# EAGLE design cerebro5.8 (EAGLE 9.6.2)
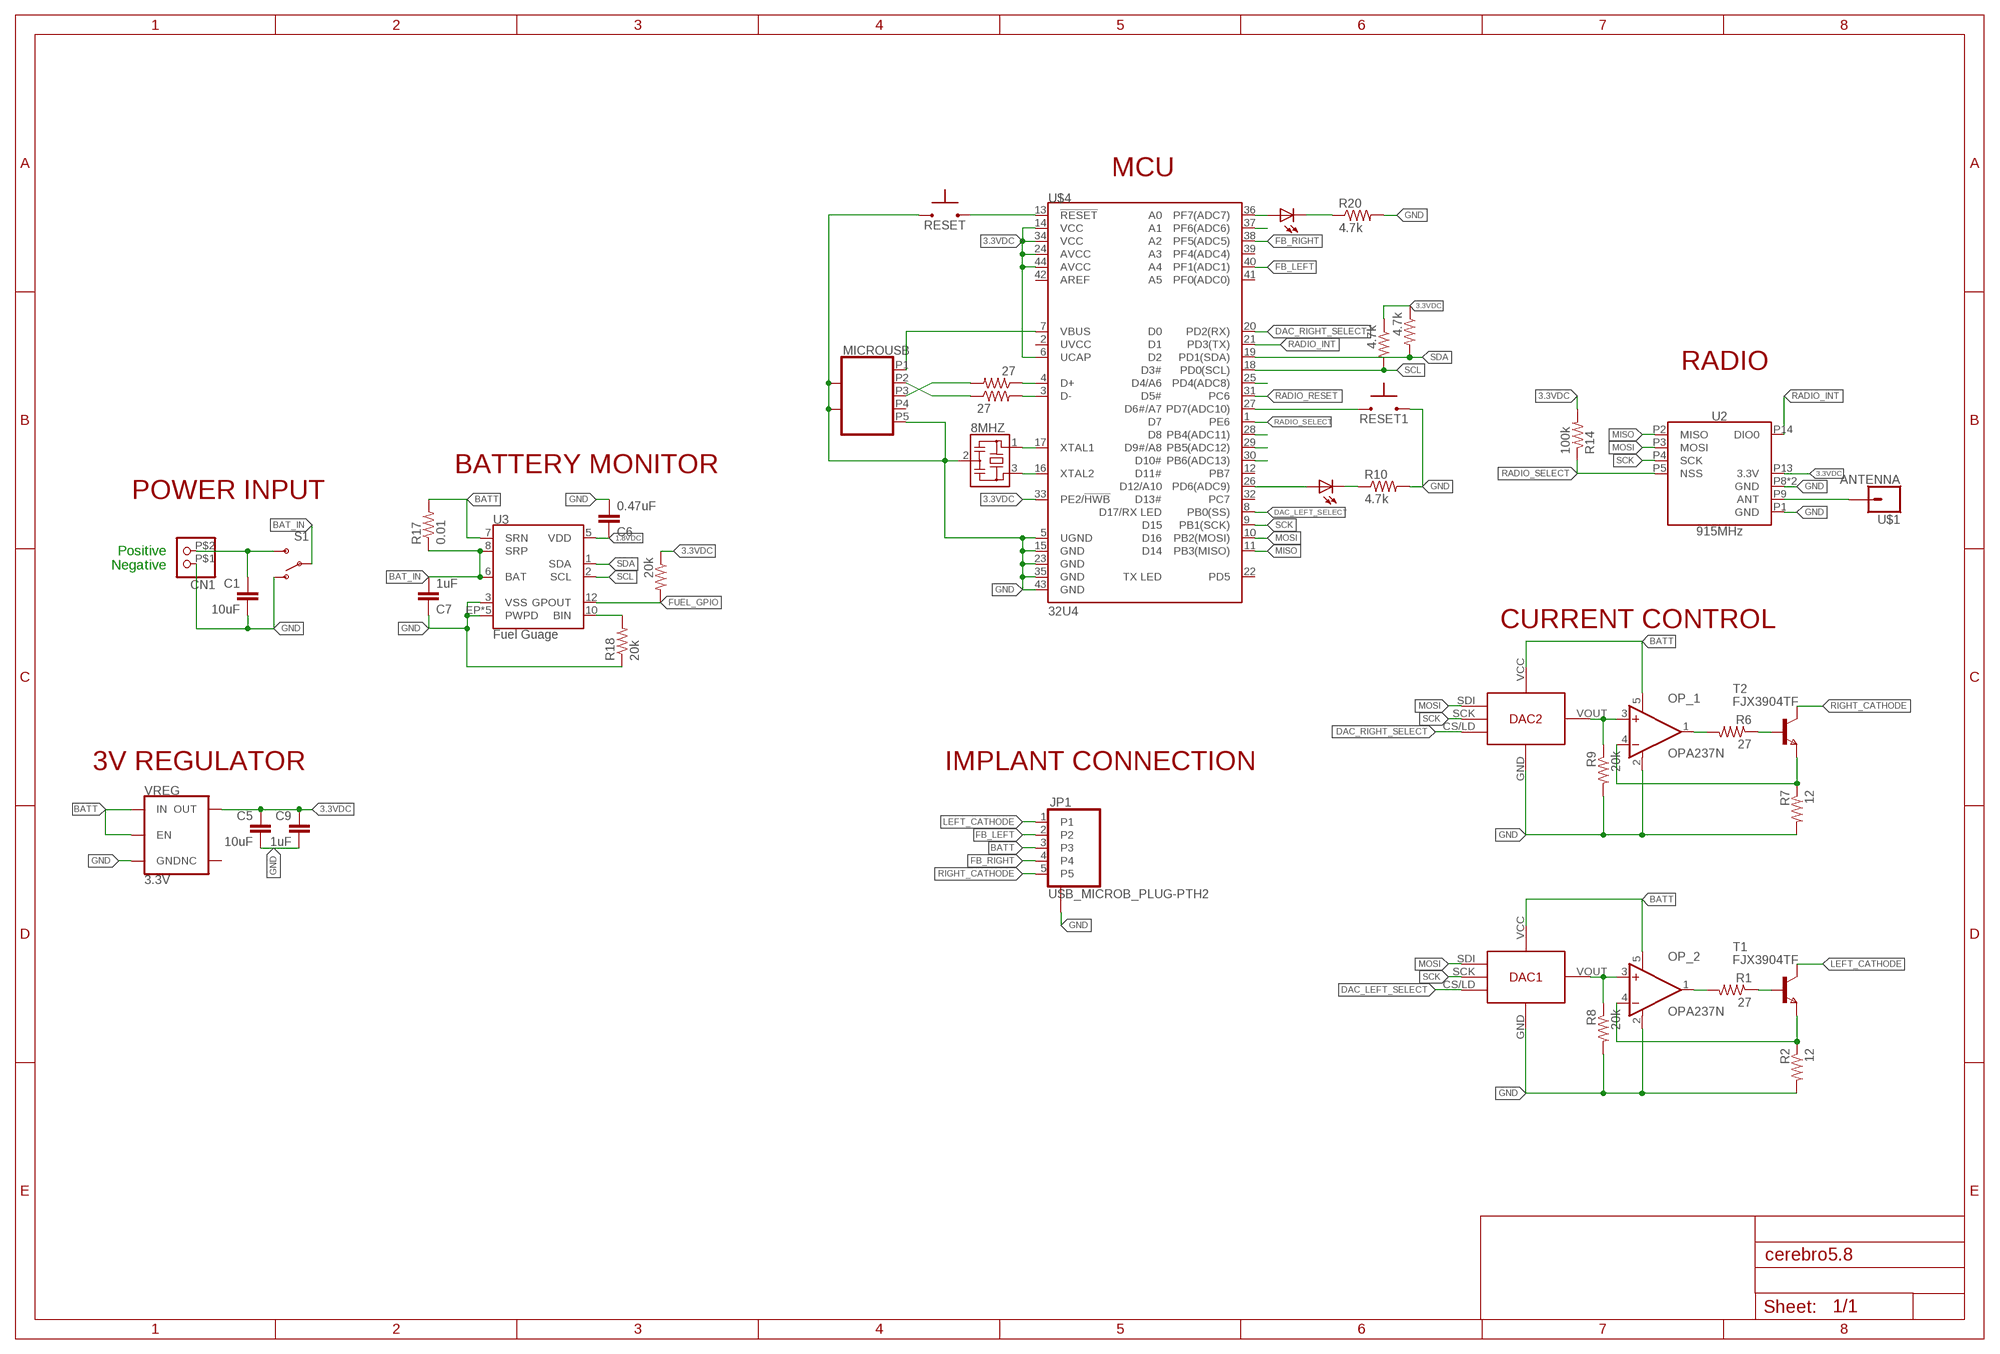
[diagram p0: schematic, sheet 1]

## Parts
8MHZ  RESONATOR_CSTCE_V  [CSTCE_V]
C1  10uF  10UF-0805-10V-10%  [0805]
C5  10uF  10UF-0805-10V-10%  [0805]
C6  0.47uF  10UF-0805-10V-10%  [0805]
C7  1uF  10UF-0805-10V-10%  [0805]
C9  1uF  10UF-0805-10V-10%  [0805]
CN1  JST_2PINMICRO  [MICRO_LOCK_2PIN]
DAC1  DAC  DAC_LTC2630  [SC-70]
DAC2  DAC  DAC_LTC2630  [SC-70]
INDICATOR_LED1  YLW  LEDCHIP-LED0603  [CHIP-LED0603]
INDICATOR_LED2  GRN  LEDCHIP-LED0603  [CHIP-LED0603]
JP1  USB_MICROB_PLUG-PTH2  [MICRO-B-TH]
MICROUSB  USB_MICRO_SOCKET_HORZ_REINFORCED  [USB_HORZ_REINFORCED_MICRO]
OP_1  OPA237N  [SOT23-5]
OP_2  OPA237N  [SOT23-5]
R1  27  RESISTOR0603-RES  [0603-RES]
R2  12  RESISTOR0603-RES  [0603-RES]
R6  27  RESISTOR0603-RES  [0603-RES]
R7  12  RESISTOR0603-RES  [0603-RES]
R8  20k  RESISTOR0603-RES  [0603-RES]
R9  20k  RESISTOR0603-RES  [0603-RES]
R10  4.7k  RESISTOR0603-RES  [0603-RES]
R12  27  RESISTOR0603-RES  [0603-RES]
R13  27  RESISTOR0603-RES  [0603-RES]
R14  100k  RESISTOR0603-RES  [0603-RES]
R15  4.7k  RESISTOR0603-RES  [0603-RES]
R16  4.7k  RESISTOR0603-RES  [0603-RES]
R17  0.01  RESISTOR1206  [1206]
R18  20k  RESISTOR0603-RES  [0603-RES]
R19  20k  RESISTOR0603-RES  [0603-RES]
R20  4.7k  RESISTOR0603-RES  [0603-RES]
RESET  SWITCH-MOMENTARY-NO  [SWITCH_MOMENTARY_XS]
RESET1  SWITCH-MOMENTARY-NO  [SWITCH_MOMENTARY_XS]
S1  SWITCH-SPDTREINFORCED_SMD  [SWITCH-SPDT-SMD-REINFORCED]
T1  FJX3904TF  NPNSOT323  [SOT323]
T2  FJX3904TF  NPNSOT323  [SOT323]
U2  915MHz  RFM69HCW-915  [RFM69HCW-XXXS2]
U3  Fuel Guage  BQ27441-G1  [PDSO-N12]
U$1  ANTENNA  [1X01]
U$4  32U4  ATMEGA32U4QFN2  [QFN-44-NOPAD]
VREG  3.3V  V_REG_AP2112K-3.3V  [SOT23-5]

## Nets
1.8VDC: C6.1 U3.5(VDD)
3.3VDC: C5.1 C9.1 R14.2 R15.1 R16.1 R19.1 U2.P13(3.3V) U$4.6(UCAP) U$4.14(VCC) U$4.24(AVCC) U$4.33(PE2/!HWB) U$4.34(VCC) U$4.44(AVCC) VREG.5(OUT)
BAT_IN: C7.2 R17.1 S1.2(P) U3.6(BAT) U3.8(SRP)
BATT: DAC1.VCC(VIN) DAC2.VCC(VIN) JP1.3 OP_1.5(V+) OP_2.5(V+) R17.2 U3.7(SRN) VREG.1(IN) VREG.3(EN)
DAC_LEFT_SELECT: DAC1.CS/LD U$4.8(PB0(SS))
DAC_RIGHT_SELECT: DAC2.CS/LD U$4.20(PD2(RX))
FB_LEFT: JP1.2 U$4.40(PF1(ADC1))
FB_RIGHT: JP1.4 U$4.38(PF5(ADC5))
FUEL_GPIO: R19.2 U3.12(GPOUT)
GND: 8MHZ.2 C1.2 C5.2 C6.2 C7.1 C9.2 CN1.P$1 DAC1.GND DAC2.GND JP1.P$1(GND_PINS) JP1.P$2(GND_PINS) MICROUSB.G1 MICROUSB.G2 MICROUSB.P5 MICROUSB.P$1 MICROUSB.P$2 OP_1.2(V-) OP_2.2(V-) R2.2 R7.2 R8.2 R9.2 R10.2 R18.1 R20.2 RESET1.P$2 RESET.P$1 S1.1(O) U2.P1(GND) U2.P8(GND) U2.P10(GND) U3.3(VSS) U3.EP1(PWPD) U3.EP2(PWPD) U3.EP3(PWPD) U3.EP4(PWPD) U3.EP(PWPD) U$4.5(UGND) U$4.15(GND) U$4.23(GND) U$4.35(GND) U$4.43(GND) VREG.2(GND)
LEFT_CATHODE: JP1.1 T1.1(C)
MISO: U2.P2(MISO) U$4.11(PB3(MISO))
MOSI: DAC1.SDI DAC2.SDI U2.P3(MOSI) U$4.10(PB2(MOSI))
N$1: DAC2.VOUT OP_1.3(+IN) R9.1
N$2: OP_1.4(-IN) R7.1 T2.3(E)
N$3: DAC1.VOUT OP_2.3(+IN) R8.1
N$4: C1.1 CN1.P$2 S1.3(S)
N$5: OP_1.1(OUT) R6.2
N$6: OP_2.4(-IN) R2.1 T1.3(E)
N$7: R6.1 T2.2(B)
N$9: OP_2.1(OUT) R1.2
N$11: R1.1 T1.2(B)
N$12: 8MHZ.1 U$4.17(XTAL1)
N$13: 8MHZ.3 U$4.16(XTAL2)
N$14: MICROUSB.P1 U$4.7(VBUS)
N$16: R12.1 U$4.4(D+)
N$17: R13.2 U$4.3(D-)
N$18: MICROUSB.P3 R12.2
N$19: MICROUSB.P2 R13.1
N$20: INDICATOR_LED2.C R10.1
N$21: RESET1.P$1 U$4.27(PD7(ADC10))
N$22: U2.P9(ANT) U$1.1
N$23: U$4.37(PF6(ADC6))
N$24: INDICATOR_LED1.C R20.1
N$25: INDICATOR_LED1.A U$4.36(PF7(ADC7))
N$26: R18.2 U3.10(BIN)
N$27: U$4.28(PB4(ADC11))
N$28: U$4.29(PB5(ADC12))
N$29: INDICATOR_LED2.A U$4.26(PD6(ADC9))
N$30: U$4.30(PB6(ADC13))
N$31: U$4.25(PD4(ADC8))
RADIO_INT: U2.P14(DIO0) U$4.21(PD3(TX))
RADIO_RESET: U$4.31(PC6)
RADIO_SELECT: R14.1 U2.P5(NSS) U$4.1(PE6)
RESET: RESET.P$2 U$4.13(!RESET)
RIGHT_CATHODE: JP1.5 T2.1(C)
SCK: DAC1.SCK DAC2.SCK U2.P4(SCK) U$4.9(PB1(SCK))
SCL: R15.2 U3.2(SCL) U$4.18(PD0(SCL))
SDA: R16.2 U3.1(SDA) U$4.19(PD1(SDA))
Unconnected: MICROUSB.P4 U$4.2(UVCC) U$4.12(PB7) U$4.22(PD5) U$4.32(PC7) U$4.39(PF4(ADC4)) U$4.41(PF0(ADC0)) U$4.42(AREF) VREG.4(NC)

## Notes on the sheet
- MCU
- RADIO
- BATTERY MONITOR
- POWER INPUT
- Positive
- Negative
- CURRENT CONTROL
- 3V REGULATOR | IMPLANT CONNECTION

## Library data of the parts
8MHZ = Cerebro-library:RESONATOR: 16 MHz Resonator(Murata p/n CSTCE16M0V53-R0) Digikey: 490-1198-1-ND <http://www.digikey.com/product-search/en?keywords=490-1198-1-nd>
C1 C5 = Cerebro-library:10UF: 10.0µF ceramic capacitors A capacitor is a passive two-terminal electrical component used to store electrical energy temporarily in an electric field.; PROD_ID: CAP-11330
C6 C7 C9 = Cerebro-library:10UF: 10.0µF ceramic capacitors A capacitor is a passive two-terminal electrical component used to store electrical energy temporarily in an electric field.; PROD_ID: CAP-11330; VALUE: 10uF
CN1 = Cerebro-library:JST_2PIN: JST 2-Pin Connectors of various flavors SMT-RA (S2B-PH-SM4) 4UConnector #17311 SMT (B2B-PH-SM4) THM-RA (S2B-PH) THM (B2B-PH)
DAC1 DAC2 = Cerebro-library:DAC_LTC2630
INDICATOR_LED1 INDICATOR_LED2 = led:LED: LED OSRAM: - CHIPLED LG R971, LG N971, LY N971, LG Q971, LY Q971, LO R971, LY R971 LH N974, LH R974 LS Q976, LO Q976, LY Q976 LO Q996 - Hyper CHIPLED LW Q18S LB Q993, LB Q99A, LB R99A - SideLED LS A670, LO A670, LY A670, LG A670, LP A670 LB A673, LV A673, LT A673, LW A673 LH A674 LY A675 LS A676, LA A676, LO A676, LY A676, LW A676 LS A679, LY A679, LG A679 - Hyper Micro SIDELED® LS Y876, LA Y876, LO Y876, LY Y876 LT Y87S - SmartLED LW L88C, LW L88S LB L89C, LB L89S, LG L890 LS L89K, LO L89K, LY L89K LS L896, LA L896, LO L896, LY L896 - TOPLED LS T670, LO T670, LY T670, LG T670, LP T670 LSG T670, LSP T670, LSY T670, LOP T670, LYG T670 LG T671, LOG T671, LSG T671 LB T673, LV T673, LT T673, LW T673 LH T674 LS T676, LA T676, LO T676, LY T676, LB T676, LH T676, LSB T676, LW T676 LB T67C, LV T67C, LT T67C, LS T67K, LO T67K, LY T67K, LW E67C LS E67B, LA E67B, LO E67B, LY E67B, LB E67C, LV E67C, LT E67C LW T67C LS T679, LY T679, LG T679 LS T770, LO T770, LY T770, LG T770, LP T770 LB T773, LV T773, LT T773, LW T773 LH T774 LS E675, LA E675, LY E675, LS T675 LS T776, LA T776, LO T776, LY T776, LB T776 LHGB T686 LT T68C, LB T68C - Hyper Mini TOPLED® LB M676 - Mini TOPLED Santana® LG M470 LS M47K, LO M47K, LY M47K Source: http://www.osram.convergy.de LUXEON: - LUMILED® LXK2-PW12-R00, LXK2-PW12-S00, LXK2-PW14-U00, LXK2-PW14-V00 LXK2-PM12-R00, LXK2-PM12-S00, LXK2-PM14-U00 LXK2-PE12-Q00, LXK2-PE12-R00, LXK2-PE12-S00, LXK2-PE14-T00, LXK2-PE14-U00 LXK2-PB12-K00, LXK2-PB12-L00, LXK2-PB12-M00, LXK2-PB14-N00, LXK2-PB14-P00, LXK2-PB14-Q00 LXK2-PR12-L00, LXK2-PR12-M00, LXK2-PR14-Q00, LXK2-PR14-R00 LXK2-PD12-Q00, LXK2-PD12-R00, LXK2-PD12-S00 LXK2-PH12-R00, LXK2-PH12-S00 LXK2-PL12-P00, LXK2-PL12-Q00, LXK2-PL12-R00 Source: www.luxeon.com KINGBRIGHT: KA-3528ASYC Source: www.kingbright.com
JP1 = Cerebro-library:USB_MICROB_PLUG: USB Micro-B connectors Some male, some female. Watch your step!
MICROUSB = Cerebro-library:USB_MICRO_SOCKET: horizontal socket. Digikey 609-4616-1-ND
OP_1 OP_2 = Cerebro-library:OPA237: Operational Amplifiers Single-Supply, MicroAmplifier(TM) Series; MF: TEXAS INSTRUMENTS; MPN: OPA237NA/250; OC_FARNELL: 4625298; OC_NEWARK: 35C1874
R1 R2 R6-R10 R12-R20 = Cerebro-library:RESISTOR: Resistor Basic schematic elements and footprints for 0603, 1206, and PTH resistors.
RESET RESET1 = Cerebro-library:SWITCH-MOMENTARY-NO
S1 = Cerebro-library:SWITCH-SPDT: SPDT Switch slide switch: AYZ0102AGRLC <http://www.digikey.com/product-detail/en/c-k/AYZ0102AGRLC/401-2012-1-ND/1640121> vertical toggle: ATE1D-2M3-10-Z <http://www.digikey.com/product-search/en?keywords=ATE1D-2M3-10-Z> horizontal toggle: ATE1D-5M3-10-Z <http://www.digikey.com/product-search/en?keywords=ATE1D-5M3-10-Z>
T1 T2 = Cerebro-library:NPNSOT323: NPN TRANSISTOR; MPN: DSS4160U-7; OC_FARNELL: 1710696; OC_NEWARK: 25R4558
U2 = Cerebro-library:RFM69H: Hope RF RFM69H ISM Transceiver Module The RFM69H is a transceiver module capable of operation over a wide frequency range, including the 315,433,868 and 915MHz license-free ISM (Industry Scientific and Medical) frequency bands. All major RF communication parameters are programmable and most of them can be dynamically set. The RFM69H offers the unique advantage of programmable narrow-band and wide- band communication modes. The RFM69H is optimized for low power consumption while offering high RF output power and channelized operation.Compliance ETSI and FCC regulations. Datasheet <http://www.hoperf.cn/upload/docs/RF/SX/RFM69H_DataSheet_v1.3.pdf> SparkFun Products RFM69HCW Wireless Transceiver - 915MHz <https://www.sparkfun.com/products/13909> (COM-13909) RFM69HCW Wireless Transceiver - 434MHz <https://www.sparkfun.com/products/13910> (COM-13910) SparkFun RFM69 Breakout (915MHz) <https://www.sparkfun.com/products/12775> (WRL-12775) SparkFun RFM69 Breakout (434MHz) <https://www.sparkfun.com/products/12823> (WRL-12823); PROD_ID: IC-11997
U3 = Cerebro-library:BQ27441-G1: Texas Instruments BQ27441-G1 LiPo Battery Fuel Gauge The Texas Instruments bq27441-G1 fuel gauge is a microcontroller peripheral that provides system-side fuel gauging for single-cell Li-Ion batteries. The device requires minimal user configuration and system microcontroller firmware development. The bq27441-G1 battery fuel gauge uses the patented Impedance Track™ algorithm for fuel gauging, and provides information such as remaining battery capacity (mAh), state-of-charge (%), and battery voltage (mV). Datasheet <http://www.ti.com/product/BQ27441-G1/datasheet> SparkFun Products SparkFun Battery Babysitter <https://www.sparkfun.com/products/13777> (PRT-13777); PROD_ID: IC-13220
U$1 = Cerebro-library:ANTENNA
U$4 = Cerebro-library:ATMEGA32U4: Atmel MCU, 32KByte Atmel 44-pin 8-bit Microcontroller with 32KBytes of ISP Flash and USB Controller Datasheet <http://cdn.sparkfun.com/datasheets/Dev/Arduino/Boards/ATMega32U4.pdf> SparkFun Products LilyPad Arduino USB - ATmega32U4 Board <https://www.sparkfun.com/products/12049> (DEV-12049) Pro Micro - 5V/16MHz <https://www.sparkfun.com/products/12640> (DEV-12640) Pro Micro - 3.3V/8MHz <https://www.sparkfun.com/products/12587> (DEV-12587) Fio v3 - ATmega32U4 <https://www.sparkfun.com/products/11520> (DEV-11520) Qduino Mini <https://www.sparkfun.com/products/13614> (DEV-13614) Makey Makey - Standard Kit <https://www.sparkfun.com/products/11511> (WIG-11511) Makey Makey Deluxe Kit <https://www.sparkfun.com/products/11519> (WIG-11519); PROD_ID: IC-10828
VREG = Cerebro-library:V_REG_AP2112: AP2112 - 600mA CMOS LDO Regulator w/ Enable The AP2112 is CMOS process low dropout linear regulator with enable function, the regulator delivers a guaranteed 600mA (min.) continuous load current. Features Output Voltage Accuracy: ±1.5% Output Current: 600mA (Min.) Foldback Short Current Protection: 50mA Enable Function to Turn ON/OFF VOUT Low Dropout Voltage (3.3V): 250mV (Typ.) @IOUT=600mA Excellent Load Regulation: 0.2%/A (Typ.) Excellent Line Regulation: 0.02%/V (Typ.) Low Quiescent Current: 55μA (Typ.) Low Standby Current: 0.01μA (Typ.) Low Output Noise: 50μVRMS PSRR: 100Hz -65dB, 1kHz -65dB OTSD Protection Stable with 1.0μF Flexible Cap: Ceramic, Tantalum and Aluminum Electrolytic Operation Temperature Range: -40°C to 85°C ESD: MM 400V, HBM 4000V; PROD_ID: VREG-12457

## Board
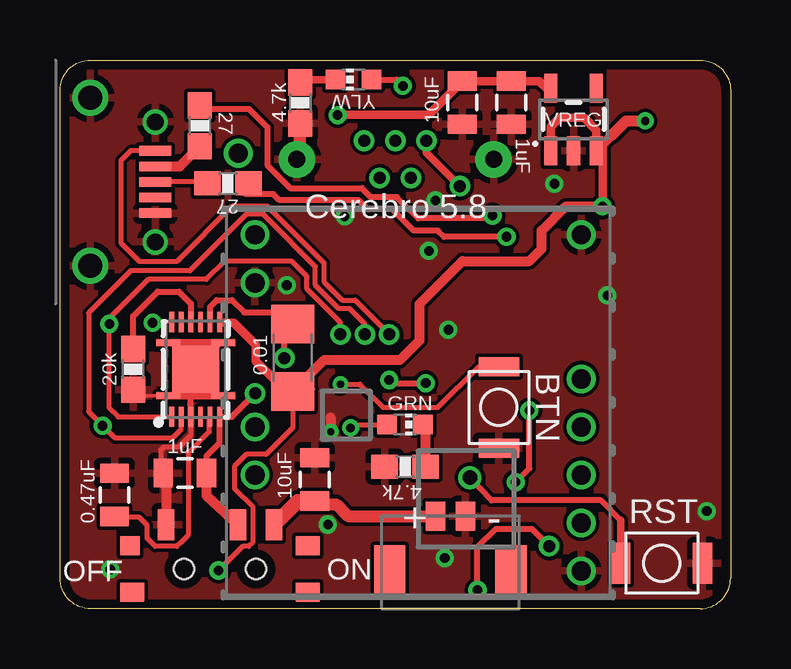
[diagram p1: board, top side]
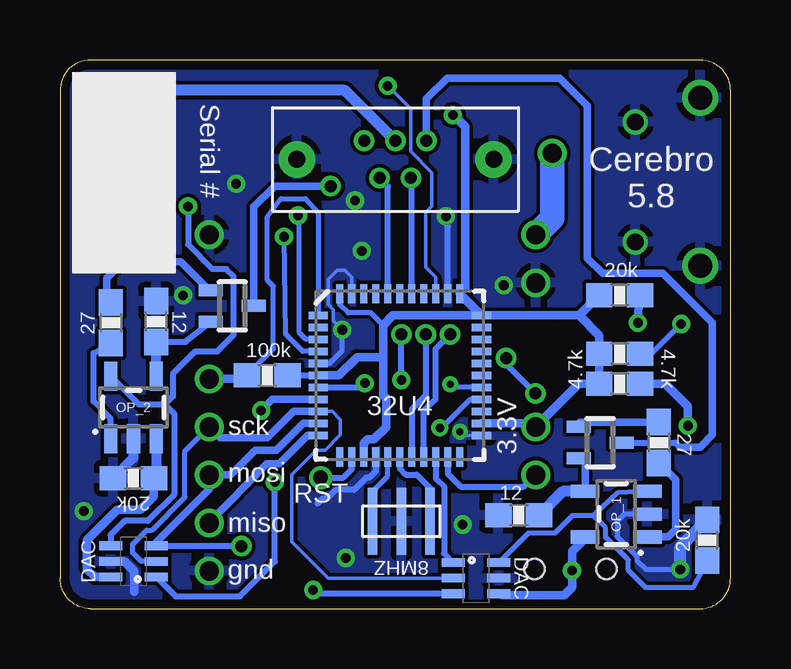
[diagram p2: board, bottom side, seen from below]

Size 27.94 x 22.86 mm. Coordinates in mm from the lower left corner, seen from the top.
Outline: 26.67,0 1.27,0 arc-90 0,1.27 0,21.59 arc-90 1.27,22.86 26.67,22.86 arc-90 27.94,21.59 27.94,1.27 arc-90 26.67,0
Copper layers (1*16): Top 0.0356mm / dielectric 1.5011mm / Bottom 0.0356mm
Design rules "LaenPCBOrder *": minimum track width 6mil, minimum drill 10mil, track to track 6mil, track to pad 6mil, pad to pad 6mil, via to via 6mil, smd to smd 6mil, copper to edge 15mil, drill to drill 6mil, minimum pad ring 7mil, minimum via ring 7mil, stop-mask expansion 3mil, vias tented up to drill 25mil, thermal gap 10mil

### Footprints (pad centres in the part's own frame; a part is rotated, then mirrored left to right if it is on the bottom)
CSTCE_V = smd 0.4 x 2.794: 1 -1.2,0; 2 0,0; 3 1.2,0
0805 = smd 0.8 x 1.2: 1 -0.9,0; 2 0.9,0
MICRO_LOCK_2PIN = smd 0.8 x 1.2: P$1 -0.625,0; P$2 0.625,0 | smd 1.3 x 2.15: P$3 -2.525,2.295; P$4 2.525,2.295
SC-70 = smd 0.36 x 0.95: CS/LD -0.65,-0.95; GND 0,0.95; SCK 0,-0.95; SDI 0.65,-0.95; VCC 0.65,0.95; VOUT -0.65,0.95
CHIP-LED0603 = smd 0.8 x 0.8: A 0,-0.75; C 0,0.75
MICRO-B-TH = drill 0.5 pad 0.813: 1 -1.3,-0.775; 2 -0.65,0.775; 3 0,-0.775; 4 0.65,0.775; 5 1.3,-0.775 | drill 0.7 pad 1.524: P$1 -4.1,0; P$2 4.1,0
USB_HORZ_REINFORCED_MICRO = drill 1: G1 -3.5,0; G2 3.5,0 | smd 0.4 x 1.35: P1 -1.3,2.7; P2 -0.65,2.7; P3 0,2.7; P4 0.65,2.7; P5 1.3,2.7 | drill 0.7: P$1 -2.5,2.7; P$2 2.5,2.7
SOT23-5 = smd 0.55 x 1.2: 1 -0.95,-1.3; 2 0,-1.3; 3 0.95,-1.3; 4 0.95,1.3; 5 -0.95,1.3
0603-RES = smd 1.1 x 1: 1 -0.85,0; 2 0.85,0
1206 = smd 1.6 x 1.8: 1 -1.4,0; 2 1.4,0
SWITCH_MOMENTARY_XS = smd 0.8 x 1.7: P$1 -1.7,0; P$2 1.7,0
SWITCH-SPDT-SMD-REINFORCED = smd 0.7 x 1.3: 1 -2.25,1.85; 2 0.75,1.85; 3 2.25,1.85 | smd 0.8 x 0.8: P$4 -3.75,0.965 | smd 1 x 0.8: P$5 -3.65,-0.965; P$6 3.65,0.965; P$7 3.65,-0.965 | hole 0.85: -1.5,0; 1.5,0
SOT323 = smd 0.5 x 1: 1 0,0.9; 2 -0.65,-0.9; 3 0.65,-0.9
RFM69HCW-XXXS2 = drill 0.8: P1 -6.8,7; P2 -6.8,5; P3 -6.8,3; P4 -6.8,1; P5 -6.8,-1; P8 -6.8,-7; P9 6.8,-7; P10 6.8,-5; P13 6.8,1; P14 6.8,3
PDSO-N12 = smd 0.2 x 0.85: 1 -1,-1.975; 2 -0.6,-1.975; 3 -0.2,-1.975; 4 0.2,-1.975; 5 0.6,-1.975; 6 1,-1.975; 7 1,1.975; 8 0.6,1.975; 9 0.2,1.975; 10 -0.2,1.975; 11 -0.6,1.975; 12 -1,1.975 | smd 1.95 x 1.95: EP 0,0 | smd 1 x 0.25: EP1 -1.15,1.1; EP2 -1.15,-1.1; EP3 1.15,-1.1; EP4 1.15,1.1
1X01 = drill 0.8: 1 0,0
QFN-44-NOPAD = smd 0.8 x 0.3: 1 -3.4,2.5; 2 -3.4,2; 3 -3.4,1.5; 4 -3.4,1; 5 -3.4,0.5; 6 -3.4,0; 7 -3.4,-0.5; 8 -3.4,-1; 9 -3.4,-1.5; 10 -3.4,-2; 11 -3.4,-2.5; 23 3.4,-2.5; 24 3.4,-2; 25 3.4,-1.5; 26 3.4,-1; 27 3.4,-0.5; 28 3.4,0; 29 3.4,0.5; 30 3.4,1; 31 3.4,1.5; 32 3.4,2; 33 3.4,2.5 | smd 0.3 x 0.8: 12 -2.5,-3.4; 13 -2,-3.4; 14 -1.5,-3.4; 15 -1,-3.4; 16 -0.5,-3.4; 17 0,-3.4; 18 0.5,-3.4; 19 1,-3.4; 20 1.5,-3.4; 21 2,-3.4; 22 2.5,-3.4; 34 2.5,3.4; 35 2,3.4; 36 1.5,3.4; 37 1,3.4; 38 0.5,3.4; 39 0,3.4; 40 -0.5,3.4; 41 -1,3.4; 42 -1.5,3.4; 43 -2,3.4; 44 -2.5,3.4

### Placement (x,y rotation side)
8MHZ  13.72,3.64 180 bottom
C1  10.62,5.38 90 top
C5  16.76,21.08 270 top
C6  2.27,4.74 90 top
C7  5.21,5.65 0 top
C9  18.8,21.08 270 top
CN1  16.27,3.85 180 top
DAC1  24.88,1.97 90 bottom
DAC2  10.6,1.27 270 bottom
INDICATOR_LED1  12.23,22.05 90 top
INDICATOR_LED2  14.38,7.67 270 top
JP1  13.97,18.72 180 top
MICROUSB  1.27,17.78 270 top
OP_1  4.76,3.94 90 bottom
OP_2  24.88,8.38 0 bottom
R1  25.82,11.91 270 bottom
R2  23.94,11.96 90 bottom
R6  2.98,6.92 270 bottom
R7  8.83,3.9 180 bottom
R8  24.88,5.44 180 bottom
R9  0.97,2.85 90 bottom
R10  14.38,5.92 180 top
R12  7,17.72 180 top
R13  5.83,20.12 90 top
R14  19.3,9.72 0 bottom
R15  4.62,9.37 0 bottom
R16  4.62,10.62 0 bottom
R17  9.7,10.45 270 top
R18  3.05,9.97 90 top
R19  4.62,13.06 0 bottom
R20  10.01,21.07 270 top
RESET  25.07,1.89 180 top
RESET1  18.29,8.38 270 top
S1  6.67,1.65 0 top
T1  20.76,12.61 270 bottom
T2  5.44,6.92 270 bottom
U2  14.92,8.57 180 top
U3  5.65,9.97 0 top
U$1  7.43,18.97 0 bottom
U$4  13.78,9.72 0 bottom
VREG  21.4,20.38 0 top

### Tracks (layer width: path | path; a pad name or v marks a point on that pad's centre or on a via)
1.8VDC
  Top 0.152: 6.22,7.97 U3.5
  Top 0.203: 6.22,7.97 6.22,7.37 5.33,6.48 5.33,3.06 5.02,2.75 4.87,2.6 3.96,2.6 3.63,2.93 3.63,3.48 3.3,3.81 2.3,3.81 C6.1 2.31,3.8
3.3VDC  (via drill 0.4)
  Top 0.203: 17.41,21.98 C5.1
  Top 0.356: VREG.5 20.36,21.59 19.96,21.98 C9.1 C5.1 15.36,20.57 11.58,20.57 v11.57,20.56
  Bottom 0.203: 14.48,11.81 14.99,12.32 15.94,12.32 16.28,12.66 U$4.44 | U$4.34 11.06,13.34
  Bottom 0.254: 16.26,13.09 U$4.44 | R14.2 U$4.6
  Bottom 0.356: U$4.24 8.27,7.71 U2.P13 6.32,9.37 R15.1 R16.1 5.47,11.38 6.31,12.22 | U$4.6 16.32,9.72 15.56,10.48 14.48,10.48 | 6.31,12.22 R19.1 | U$4.33 14.07,12.22 14.48,11.81 14.48,10.48 | U$4.33 U$4.34 | U$4.33 6.31,12.22 | U$4.14 15.28,6.88 15.11,7.05 14.86,7.05 14.35,7.56 14.35,8.76 14.48,8.89 14.48,10.48 | v11.57,20.56 11.54,20.54 11.52,20.54 11.06,20.08 11.06,13.34
BAT_IN  (via drill 0.5)
  Top 0.254: C7.2 6.11,5.84 6.11,6.36 6.65,6.91 U3.6 7.16,8 v8.13,8.97 | U3.8 6.25,12.58 6.53,12.85 7.16,12.85 7.67,12.34 9.06,12.34 9.34,12.06 | v9.35,10.44 9.35,11.5 R17.1
  Top 0.305: 9.34,12.06 R17.1
  Top 0.406: S1.2 6.11,4.71 6.11,5.84
  Bottom 0.254: v8.13,8.97 9.35,10.19 v9.35,10.44
BATT  (via drill 0.35, 0.4 pad 0.25)
  Top 0.152: v22.61,16.76 22.61,17.68
  Top 0.203: U3.7 6.65,11.92 6.85,11.92 | R17.2 9.7,7.54 8.59,6.43 7.77,6.43 7.27,5.93 7.27,5.01 8.02,4.26 8.02,2.75 7.87,2.6 7.61,2.6 v6.6,1.59
  Top 0.254: 9.2,9.4 R17.2 | VREG.3 22.61,19.34
  Top 0.356: VREG.3 22.35,19.94 21.84,20.45 20.83,20.45 20.45,20.07 VREG.1 | 22.61,19.34 v22.61,16.76 | 9.4,8.7 9.21,8.89 | 6.85,11.92 7.23,11.92 8.15,11 8.15,10.31 9.04,9.42
  Top 0.406: 10.41,9.14 9.34,9.14 R17.2 | 9.04,9.42 9.21,8.89 R17.2 | 9.4,9 arc90 R17.2 | VREG.3 22.99,19.72 | v22.61,16.76 21.08,16.76 20.07,15.75 20.07,14.99 19.56,14.48 16.76,14.48 14.99,12.7 14.99,11.18 14.17,10.36 11.01,10.36 R17.2
  Top 0.457: 22.99,19.72 23.59,20.32 v24.38,20.32
  Bottom 0.254: 6.35,3.02 OP_1.5 | OP_2.5 24.66,8.51 23.57,8.51 | v22.61,16.76 22.61,15.16 21.59,14.15 21.01,14.15 20.7,13.84 20.7,11.4 21.39,10.72 22.3,10.72 23.24,9.78 23.24,8.84 23.57,8.51 | 23.57,8.51 23.16,8.1 23.16,4.78 24.28,3.66 25.25,3.66 25.83,3.08 DAC1.VCC
  Bottom 0.356: DAC2.VCC 9.47,0.56 6.93,0.56 6.6,0.89 v6.6,1.59 6.6,2.38 6.06,2.92 OP_1.5
  Bottom 0.457: JP1.3 16.07,21.59 23.62,21.59 24.38,20.83 v24.38,20.32
DAC_LEFT_SELECT  (via drill 0.4)
  Top 0.254: v18.99,5.27 19.56,5.84 v19.56,8.26
  Bottom 0.254: DAC1.CS/LD 23.12,0.51 20.45,0.51 18.99,1.97 v18.99,5.27
  Bottom 0.305: U$4.8 19.1,8.72 v19.56,8.26
DAC_RIGHT_SELECT
  Bottom 0.254: U$4.20 12.28,5.42 11.94,5.08 11.94,2.3 DAC2.CS/LD
FB_LEFT
  Bottom 0.254: U$4.40 14.28,17.58 JP1.2
FB_RIGHT
  Bottom 0.254: U$4.38 13.28,17.88 JP1.4
FUEL_GPIO  (via drill 0.4 pad 0.25)
  Top 0.152: U3.12 3.89,11.94 v3.86,11.91
  Bottom 0.356: v3.86,11.91 3.81,13.02 R19.2
GND  (via drill 0.3, 0.4, 0.4 pad 0.25)
  Top 0.152: R18.1 3.11,8.87 U3.EP2 4.55,8.87 arc90 U3.EP | U3.EP4 6.75,11.07 6.1,10.41 | 6.1,10.41 U3.EP | U3.EP1 5.44,11.07 arc-90 6.1,10.41 | U3.EP3 6.75,8.87 arc-90 U3.EP | 4.31,6.08 C7.1 4.19,5.77 | S1.1 arc-90 4.31,3.58
  Top 0.203: U3.3 5.45,7.23 4.95,6.73 4.32,6.73 4.19,6.6 4.19,5.77
  Top 0.254: U3.3 5.45,9.77 U3.EP
  Top 0.305: C7.1 arc-90 4.48,5.48
  Top 0.406: C7.1 4.42,5.54 S1.1 | 11.28,7.96 v11.28,7.37
  Top 0.508: 10.01,18.86 R20.2
  Top 1.016: JP1.P$2 10.01,18.86
  Bottom 0.152: v11.28,7.37 10.94,7.2 U$4.23 | U$4.43 15.78,13.81 16.07,14.1 16.38,14.1 16.76,13.72 16.76,12.67 16.55,12.46 16.55,11.99 v16.18,11.62
  Bottom 0.203: U$4.5 16.71,10.22 16.18,10.74 v16.18,11.62 | OP_1.2 4.42,3.94 4.72,3.63 4.72,2.99 3.9,2.17 3.9,2.02 3.52,1.64 v2.1,1.64
  Bottom 0.254: U$4.15 14.78,5.73 15.05,5.46 15.18,5.46 15.68,4.95 16.45,4.95 16.83,4.57 17.02,4.57 17.21,4.38 | v11.86,16.34 11.78,15.95 U$4.35
  Bottom 0.356: DAC1.GND 25.26,1.97 24.84,1.55 24.84,0.71
  Bottom 0.406: OP_2.2 24.88,6.29 R8.2
  Bottom 0.508: v2.1,1.64 2.1,2.58 R9.2
  other vias: 16.03,2.11 26.95,4.06 22.81,13.06 15.65,17.01 9.45,13.47 11.16,3.51 15.37,14.91 20.6,17.7
  pour Top: -2.54,25.4 30.48,25.4 30.48,-2.54 -2.54,-2.54
  pour Bottom: 30.48,25.4 -2.54,25.4 -2.54,-2.29 30.48,-2.54
LEFT_CATHODE  (via drill 0.5)
  Top 0.305: v16.66,17.6 15.27,19 JP1.1
  Bottom 0.305: v16.66,17.6 19,17.6 19.86,16.74 T1.1
MISO
  Bottom 0.305: U2.P2 19.33,6.03 18.8,6.03 17.61,7.21 U$4.11
MOSI  (via drill 0.4, 0.5)
  Top 0.254: v17.39,0.78 17.39,2.55 18.17,3.33 19.66,3.33 v20.38,2.6
  Bottom 0.254: v20.38,2.6 23.91,2.6 | DAC2.SDI 17.29,0.62 17.39,0.73 v17.39,0.78
  Bottom 0.305: U$4.10 17.81,7.71 18.92,6.6 19.81,6.6 20.83,5.59 21.71,5.59 U2.P3 21.72,4.97 23.93,2.77 DAC1.SDI
  Bottom 0.356: DAC1.SDI 23.91,2.6
N$1
  Bottom 0.203: OP_1.3 4.7,4.82 5.71,3.87 | 5.71,3.87 5.21,3.37 5.21,2.97 4.26,2.03 4.26,1.59 3.56,0.89 1.56,0.89 R9.1 | DAC2.VOUT 8.43,3.15 7.32,3.15 6.59,3.87 5.71,3.87
N$2
  Bottom 0.254: 6.06,6.1 T2.3
  Bottom 0.305: OP_1.4 6.06,6.1
  Bottom 0.457: R7.1 6.99,4.89 OP_1.4
N$3
  Bottom 0.254: DAC1.VOUT 25.96,1.32
  Bottom 0.356: 25.96,1.32 26.49,1.32 26.82,1.65 26.82,2.85 25.55,4.12 24.59,4.12 24.03,4.67 R8.1
  Bottom 0.406: OP_2.3 23.93,5.54 R8.1
N$4
  Top 0.508: CN1.P$2 11.99,3.85 11.51,4.34 10.76,4.34 C1.1
  Top 0.61: C1.1 9.9,4.49 S1.3
N$5
  Bottom 0.305: R6.2 2.29,5.37 2.29,3.3 2.6,2.99 OP_1.1
N$6
  Bottom 0.254: R2.1 22.71,11.11 T1.3
  Bottom 0.406: OP_2.4 23.94,10.48 R2.1
N$7
  Bottom 0.305: T2.2 6.29,7.77 R6.1
N$9
  Bottom 0.254: OP_2.1 25.83,7.92 26.54,8.64 26.54,10.64 R1.2
N$11
  Bottom 0.305: T1.2 21.84,13.38 22.91,14.45 25.3,14.45 25.98,13.77 25.98,12.9 R1.1
  Bottom 0.356: 26.07,13.09 R1.1
N$12
  Bottom 0.254: U$4.17 13.78,5.84 13.53,5.59 13.08,5.59 12.45,4.96 8MHZ.1
N$13
  Bottom 0.203: 8MHZ.3 14.79,5.02 14.35,5.46 14.29,5.52 14.29,6.31 U$4.16
N$14  (via drill 0.4, 0.4 pad 0.25, 0.5 pad 0.25)
  Top 0.203: MICROUSB.P1 2.95,19.08 2.54,18.67 2.54,15.24 3.3,14.48 4.88,14.48 7.18,16.78 8.62,16.78 10.99,14.41 10.99,13.62 11.77,12.85 12.29,12.85 v13.72,11.43
  Top 0.254: v13.72,9.53 13.84,9.4 v15.24,9.4
  Bottom 0.254: v13.72,9.53 v13.72,11.43 | U$4.7 15.42,9.22 v15.24,9.4
N$16  (via drill 0.4 pad 0.25)
  Top 0.254: R12.1 7.72,17.27 8.89,17.27 9.14,17.02 12.45,17.02 12.83,16.64 13.84,16.64 14.73,15.75 15.75,15.75 16,15.49 v18.61,15.49
  Bottom 0.203: U$4.4 17.83,10.72 18.54,11.43 v18.61,15.49
N$17  (via drill 0.4 pad 0.25)
  Top 0.254: v18.02,16.38 17.89,16.26 14.92,16.26 14.03,17.14 12.95,17.14 12.57,17.53 9.59,17.53 8.64,18.48 8.64,20.07 7.87,20.83 5.97,20.83 R13.2
  Bottom 0.203: U$4.3 17.69,11.22 17.97,11.49 17.97,16.33 v18.02,16.38
N$18
  Top 0.203: R12.2 6.02,17.78 MICROUSB.P3
N$19
  Top 0.406: MICROUSB.P2 4.99,18.43 R13.1
N$20
  Top 0.406: INDICATOR_LED2.C 15.23,7.57 R10.1
N$21  (via drill 0.3)
  Top 0.203: v11.68,9.35 12.49,9.35 13.46,8.38 15.75,8.38 17.45,10.08 RESET1.P$1 17.53,10.16
  Bottom 0.203: U$4.27 11.5,9.22 11.68,9.4 v11.68,9.35
N$22
  Bottom 1.016: U2.P9 7.43,16.27 U$1.1
N$24
  Top 0.152: 10.14,22.05 R20.1
  Top 0.305: INDICATOR_LED1.C 10.14,22.05
N$25  (via drill 0.4)
  Top 0.152: 13.03,22.1 INDICATOR_LED1.A
  Top 0.254: INDICATOR_LED1.A 14.02,22.05 v14.29,21.78
  Bottom 0.152: U$4.36 12.28,13.8 12.7,14.22 12.7,16.51 12.45,16.76 12.45,18.16 13.34,19.05 13.34,20.83 v14.29,21.78
N$26
  Top 0.254: R18.2 3.05,12.19 4.06,13.21 4.95,13.21 5.45,12.71 U3.10
N$29  (via drill 0.35)
  Top 0.203: v12.11,7.53 12.25,7.67 INDICATOR_LED2.A
  Bottom 0.203: U$4.26 10.84,8.72 12.03,7.53 v12.11,7.53
RADIO_INT
  Bottom 0.254: U2.P14 8.62,5.08 11.24,5.08 11.78,5.62 U$4.21
RADIO_SELECT
  Bottom 0.152: 20.3,9.57 R14.1 | U$4.1 17.4,12.19
  Bottom 0.203: U$4.1 17.18,16.48 17.72,17.08 18.73,17.08 19.3,16.32 19.3,13.69 19.05,13.44 19.05,10.82 R14.1
  Bottom 0.356: U2.P5 20.3,9.57
RESET  (via drill 0.6)
  Top 0.254: 23.37,3.68 22.54,4.51 17.97,4.51 v17.08,5.46
  Top 0.305: RESET.P$2 23.37,3.68
  Bottom 0.254: v17.08,5.46 16.13,5.46 15.78,5.81 U$4.13
RIGHT_CATHODE
  Bottom 0.152: T2.1 4.62,6.99
  Bottom 0.254: T2.1 2.3,6.92 2.11,6.73
  Bottom 0.305: 2.11,6.73 1.27,6.73 0.76,7.24 0.76,11.91 2.82,13.97 5.33,13.97 5.97,14.61 5.97,20.95 7.11,22.1 11.81,22.1 12.67,21.24 JP1.5
SCK
  Bottom 0.152: U$4.9 16.6,8.22 16.26,7.87 16.26,7.24 16.89,6.6 17.27,6.6 18.29,5.59 18.29,2.79 16.76,1.27 DAC2.SCK
  Bottom 0.203: DAC1.SCK 24.55,1.97 24.92,2.34 24.92,2.69 24.33,3.28 24.11,3.28 22.73,4.65 22.73,6.56 U2.P4
  Bottom 0.305: U$4.9 18.2,8.22 19.3,7.11 21.26,7.11 U2.P4
SCL  (via drill 0.4, 0.5)
  Top 0.203: U3.2 5.05,7.46 4.7,7.11 2.29,7.11 v1.78,7.62 1.19,8.2 1.19,12.32 2.95,14.07 | 2.97,14.1 2.95,14.07 | v12.7,11.43 12.7,11.87 12.07,12.5 11.62,12.5 10.64,13.48 10.64,14.25 9.66,15.23 9.66,15.24 8.48,16.43 7.77,16.43 5.41,14.07 2.95,14.07
  Bottom 0.254: v12.7,11.43 12.7,8.89 13.28,8.31 U$4.18
  Bottom 0.356: R15.2 2.72,9.37 1.78,8.43 v1.78,7.62
SDA  (via drill 0.4, 0.5)
  Top 0.203: U3.1 2.42,8 2.06,8.36 v2.06,11.86 2.06,12.09 3.68,13.72 6.1,13.72 6.86,14.48 9.65,14.48 10.28,13.85 10.28,13.33 11.68,11.93 v11.68,11.43
  Bottom 0.203: v2.06,11.86 3.3,10.62 R16.2
  Bottom 0.254: v11.68,11.43 12.29,10.82 12.29,8.72 12.78,8.24 U$4.19

### Text on the board
tNames: Cerebro 5.8 | BTN | + | - | RST | OFF | ON
bNames: Serial # | Cerebro / 5.8 | 3.3V | sck | mosi | RST | miso | gnd